# EAGLE design FTS V1.0 (EAGLE 7.5.0)
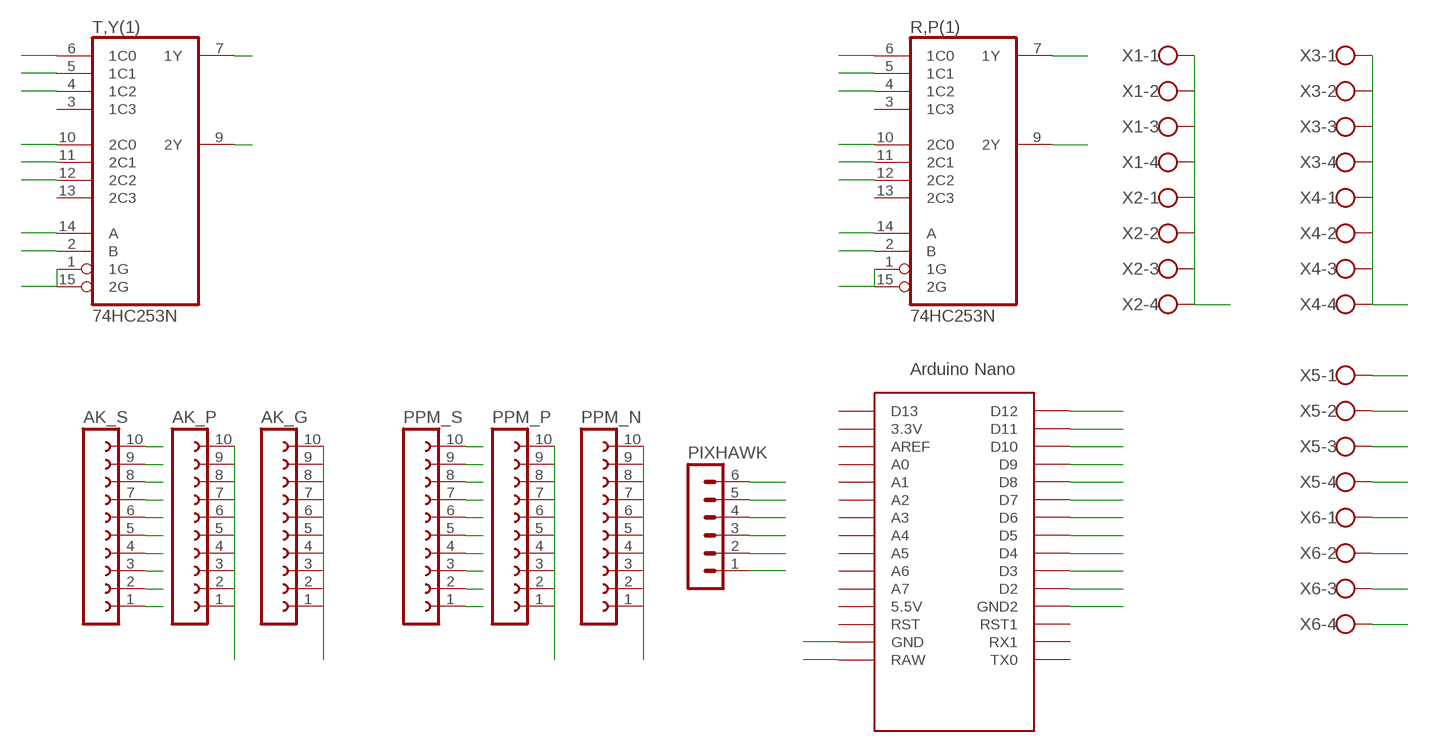
[diagram p0: schematic, sheet 1]

## Parts
AK_G  FE10-1  [FE10]
AK_P  FE10-1  [FE10]
AK_S  FE10-1  [FE10]
PIXHAWK  MA06-1  [MA06-1]
PPM_N  FE10-1  [FE10]
PPM_P  FE10-1  [FE10]
PPM_S  FE10-1  [FE10]
R,P(1)  74HC253N  [DIL16]
T,Y(1)  74HC253N  [DIL16]
U$1  NANO  [NANO]
X1  W237-4  [W237-4]
X2  W237-4  [W237-4]
X3  W237-4  [W237-4]
X4  W237-4  [W237-4]
X5  W237-4  [W237-4]
X6  W237-4  [W237-4]

## Nets
AUX2: AK_S.7 U$1.D4
DROP: AK_S.10 X6.4
FTS-P: R,P(1).12(2C2) U$1.D10
FTS-R: R,P(1).4(1C2) U$1.D9
FTS-T: T,Y(1).4(1C2) U$1.D11
FTS-Y: T,Y(1).12(2C2) U$1.D6
GBL-P: AK_S.9 X6.3
GBL-R: AK_S.8 X6.2
GEAR: AK_S.6 U$1.D5
GND: AK_G.1 AK_G.2 AK_G.3 AK_G.4 AK_G.5 AK_G.6 AK_G.7 AK_G.8 AK_G.9 AK_G.10 PIXHAWK.6 PPM_N.1 PPM_N.2 PPM_N.3 PPM_N.4 PPM_N.5 PPM_N.6 PPM_N.7 PPM_N.8 PPM_N.9 PPM_N.10 R,P(1).1(1G) R,P(1).15(2G) T,Y(1).1(1G) T,Y(1).15(2G) U$1.GND U$1.GND1(GND2) X3.1 X3.2 X3.3 X3.4 X4.1 X4.2 X4.3 X4.4
N$50: PPM_S.10
N$51: PPM_S.9
N$52: PPM_S.8
N$53: PPM_S.7
N$54: PPM_S.6
N$59: PIXHAWK.5
PPM_FM: PPM_S.5 U$1.D8
PX-P: PIXHAWK.2 R,P(1).11(2C1)
PX-R: PIXHAWK.1 R,P(1).5(1C1)
PX-T: PIXHAWK.3 T,Y(1).5(1C1)
PX-Y: PIXHAWK.4 T,Y(1).11(2C1)
RX-FM: AK_S.5 U$1.D7
RX-P: AK_S.2 PPM_S.2 R,P(1).10(2C0)
RX-R: AK_S.1 PPM_S.1 R,P(1).6(1C0)
RX-T: AK_S.3 PPM_S.3 T,Y(1).6(1C0) U$1.D12
RX-Y: AK_S.4 PPM_S.4 T,Y(1).10(2C0)
S1: R,P(1).14(A) T,Y(1).14(A) U$1.D2
S2: R,P(1).2(B) T,Y(1).2(B) U$1.D3
S-P: R,P(1).9(2Y) X5.2
S-R: R,P(1).7(1Y) X5.1
S-T: T,Y(1).7(1Y) X5.3
S-Y: T,Y(1).9(2Y) X5.4 X6.1
VCC: AK_P.1 AK_P.2 AK_P.3 AK_P.4 AK_P.5 AK_P.6 AK_P.7 AK_P.8 AK_P.9 AK_P.10 PPM_P.1 PPM_P.2 PPM_P.3 PPM_P.4 PPM_P.5 PPM_P.6 PPM_P.7 PPM_P.8 PPM_P.9 PPM_P.10 U$1.RAW X1.1 X1.2 X1.3 X1.4 X2.1 X2.2 X2.3 X2.4
Unconnected: R,P(1).3(1C3) R,P(1).13(2C3) T,Y(1).3(1C3) T,Y(1).13(2C3) U$1.3.3V U$1.5V(5.5V) U$1.A0 U$1.A1 U$1.A2 U$1.A3 U$1.A4 U$1.A5 U$1.A6 U$1.A7 U$1.AREF U$1.D13 U$1.ICSP1 U$1.ICSP2 U$1.ICSP3 U$1.ICSP4 U$1.ICSP5 U$1.ICSP6 U$1.RST U$1.RST1 U$1.RX1 U$1.TX0

## Power pins joined to a net without a drawn wire
GND: R,P(1).8(GND) T,Y(1).8(GND)
VCC: R,P(1).16(VCC) T,Y(1).16(VCC)

## Library data of the parts
AK_G AK_P AK_S PPM_N PPM_P PPM_S = con-lsta:FE10-1: FEMALE HEADER; OC_FARNELL: unknown; OC_NEWARK: unknown
PIXHAWK = con-lstb:MA06-1: PIN HEADER; OC_FARNELL: unknown; OC_NEWARK: unknown
R,P(1) T,Y(1) = 74xx-eu:74*253: Dual 4-to 1 line data SELECTOR/MULTIPLEXER, 3-state
U$1 = Arduino-clone:NANO: Arduino Nano
X1-X6 = con-wago-500:W237-4: WAGO SCREW CLAMP; OC_FARNELL: unknown; OC_NEWARK: unknown

## Board
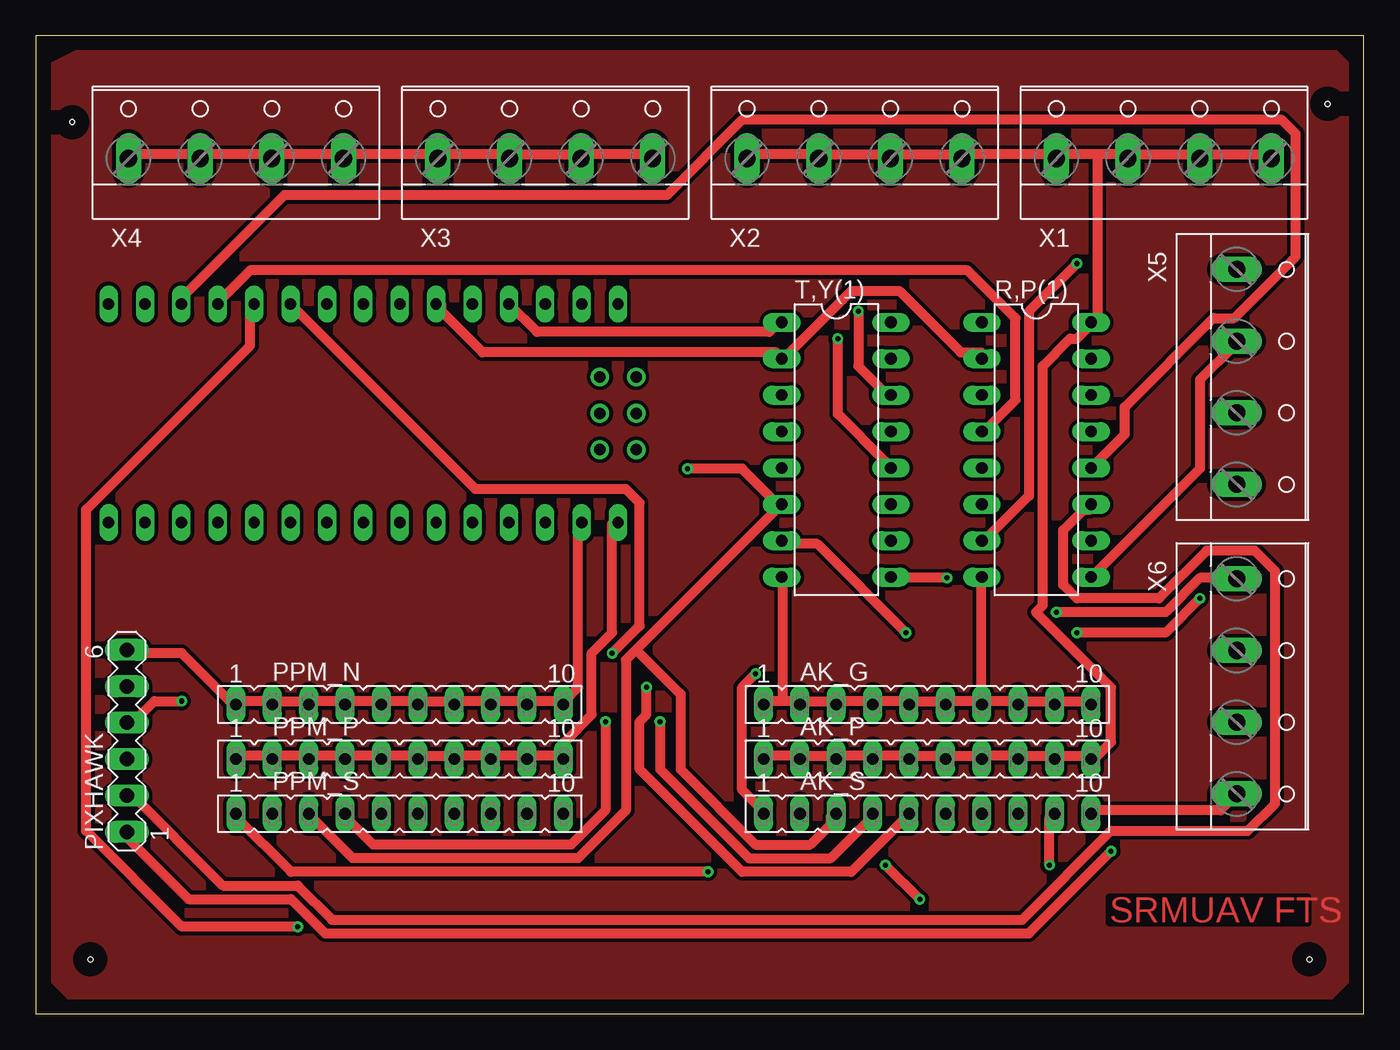
[diagram p1: board, top side]
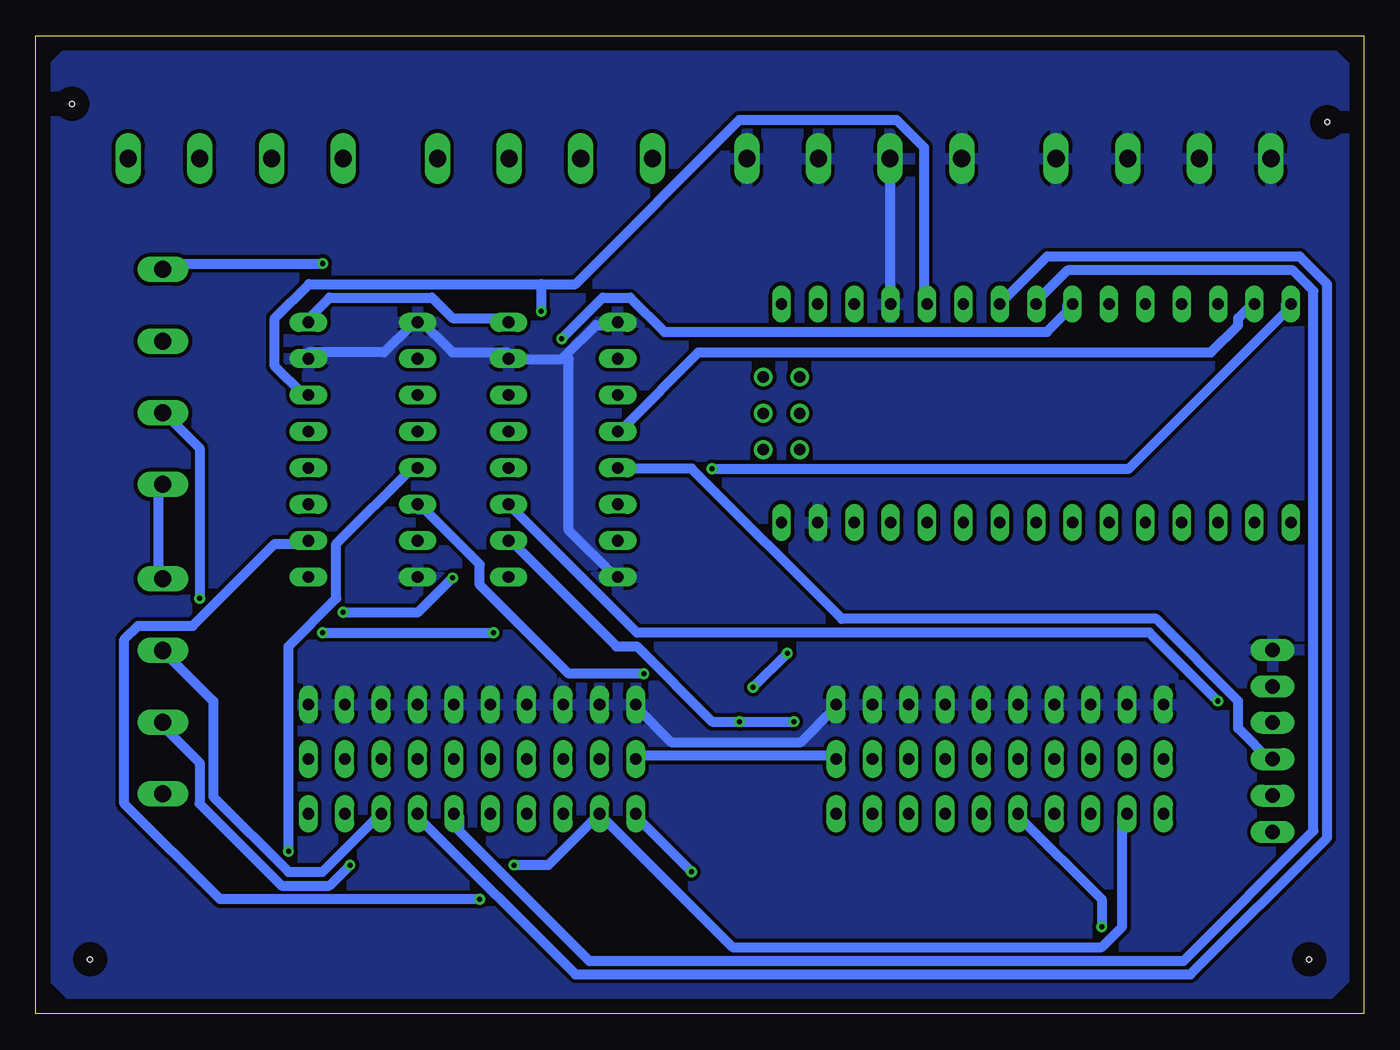
[diagram p2: board, bottom side, seen from below]

Size 92.69 x 68.25 mm. Coordinates in mm from the lower left corner, seen from the top.
Outline: 0,0 92.69,0 92.69,68.25 0,68.25 0,0
Copper layers (1*16): Top 0.035mm / dielectric 1.5mm / Bottom 0.035mm
Design rules "default *": minimum track width 0.7mm, minimum drill 0.35mm, track to track 10mil, track to pad 10mil, pad to pad 10mil, via to via 10mil, smd to smd 10mil, copper to edge 40mil, drill to drill 6mil, minimum pad ring 10mil, minimum via ring 8mil, stop-mask expansion 4mil, vias tented up to drill 0mil, thermal gap 10mil
Holes 0.35 mm at 3.81,3.81 88.9,3.81 90.17,63.5 2.54,62.23

### Footprints (pad centres in the part's own frame; a part is rotated, then mirrored left to right if it is on the bottom)
FE10 = drill 0.813 long: 1 -11.43,0; 2 -8.89,0; 3 -6.35,0; 4 -3.81,0; 5 -1.27,0; 6 1.27,0; 7 3.81,0; 8 6.35,0; 9 8.89,0; 10 11.43,0
MA06-1 = drill 1.016 long: 1 -6.35,0; 2 -3.81,0; 3 -1.27,0; 4 1.27,0; 5 3.81,0; 6 6.35,0
DIL16 = drill 0.813 long: 1 -8.89,-3.81; 2 -6.35,-3.81; 3 -3.81,-3.81; 4 -1.27,-3.81; 5 1.27,-3.81; 6 3.81,-3.81; 7 6.35,-3.81; 8 8.89,-3.81; 9 8.89,3.81; 10 6.35,3.81; 11 3.81,3.81; 12 1.27,3.81; 13 -1.27,3.81; 14 -3.81,3.81; 15 -6.35,3.81; 16 -8.89,3.81
NANO = drill 0.8 long: 3.3V -10.16,24.13; 5V -10.16,-1.27; A0 -10.16,19.05; A1 -10.16,16.51; A2 -10.16,13.97; A3 -10.16,11.43; A4 -10.16,8.89; A5 -10.16,6.35; A6 -10.16,3.81; A7 -10.16,1.27; AREF -10.16,21.59; D2 5.08,1.27; D3 5.08,3.81; D4 5.08,6.35; D5 5.08,8.89; D6 5.08,11.43; D7 5.08,13.97; D8 5.08,16.51; D9 5.08,19.05; D10 5.08,21.59; D11 5.08,24.13; D12 5.08,26.67; D13 -10.16,26.67; GND -10.16,-6.35; GND1 5.08,-1.27; RAW -10.16,-8.89; RST -10.16,-3.81; RST1 5.08,-3.81; RX1 5.08,-6.35; TX0 5.08,-8.89 | drill 0.8: ICSP1 -5.08,-10.16; ICSP2 -5.08,-7.62; ICSP3 -2.54,-10.16; ICSP4 -2.54,-7.62; ICSP5 0,-10.16; ICSP6 0,-7.62
W237-4 = drill 1.194 long: 1 -7.5,-1.27; 2 -2.5,-1.27; 3 2.5,-1.27; 4 7.5,-1.27

### Placement (x,y rotation side)
AK_G  62.23,21.59 0 top
AK_P  62.23,17.78 0 top
AK_S  62.23,13.97 0 top
PIXHAWK  6.35,19.05 90 top
PPM_N  25.4,21.59 0 top
PPM_P  25.4,17.78 0 top
PPM_S  25.4,13.97 0 top
R,P(1)  69.85,39.37 270 top
T,Y(1)  55.88,39.37 270 top
U$1  31.75,44.45 90 top
X1  78.74,60.96 0 top
X2  57.15,60.96 0 top
X3  35.56,60.96 0 top
X4  13.97,60.96 0 top
X5  85.09,44.45 270 top
X6  85.09,22.86 270 top

### Tracks (layer width: path | path; a pad name or v marks a point on that pad's centre or on a via)
AUX2
  Bottom 0.7: U$1.D4 24.97,49.98 22.11,52.84 4.46,52.84 2.55,50.93 2.55,12.29 12.09,2.75 55.02,2.75 65.99,13.73 AK_S.7
DROP
  Top 0.7: AK_S.10 74.1,14.2 82.69,14.2 83.64,15.16 X6.4
FTS-P
  Top 0.7: U$1.D10 10.18,49.98 17.34,57.13 44.05,57.13 49.3,62.38 86.98,62.38 87.94,61.43 87.94,52.84 83.64,48.55 82.21,48.55 76.01,42.35 76.01,40.44 74.1,38.53 R,P(1).12
FTS-R
  Top 0.7: U$1.D9 13.05,49.98 14.95,51.89 65.04,51.89 68.38,48.55 68.38,42.82 66.47,40.91 R,P(1).4
FTS-T
  Bottom 0.7: U$1.D11 7.8,49.5 8.75,48.55 8.75,48.07 10.66,46.16 46.44,46.16 51.68,40.91 T,Y(1).4
FTS-Y  (via drill 0.35)
  Top 0.7: v55.98,47.12 55.98,41.87 59.31,38.53 T,Y(1).12
  Bottom 0.7: v55.98,47.12 53.11,49.98 51.21,49.98 48.82,47.59 22.11,47.59 20.68,49.02 20.68,49.5 U$1.D6
GBL-P  (via drill 0.35)
  Top 0.7: v70.76,10.39 70.76,13.73 AK_S.9
  Bottom 0.7: v70.76,10.39 72.19,8.96 75.53,8.96 81.26,14.68 81.26,17.54 83.64,19.93 X6.3
GBL-R
  Bottom 0.7: AK_S.8 68.86,13.73 72.67,9.91 75.06,9.91 80.3,15.16 80.3,21.83 83.64,25.17 X6.2
GEAR
  Bottom 0.7: U$1.D5 22.59,49.98 20.68,51.89 4.94,51.89 3.51,50.45 3.51,12.77 12.57,3.71 54.07,3.71 63.13,12.77 63.13,13.73 AK_S.6
GND
  Top 0.7: X4.1 6.85,59.99 11.14,59.99 X4.2 11.62,59.99 16.38,59.99 X4.3 16.86,59.99 21.16,59.99 X4.4 21.63,59.99 27.83,59.99 X3.1 28.31,59.99 32.6,59.99 X3.2 33.08,59.99 37.85,59.99 X3.3 38.33,59.99 42.62,59.99 X3.4 | PIXHAWK.6 6.37,25.17 10.18,25.17 13.52,21.83 PPM_N.1 14,21.83 16.38,21.83 PPM_N.2 16.86,21.83 18.77,21.83 PPM_N.3 19.25,21.83 21.16,21.83 PPM_N.4 21.63,21.83 24.02,21.83 PPM_N.5 24.49,21.83 26.4,21.83 PPM_N.6 26.88,21.83 28.79,21.83 PPM_N.7 29.26,21.83 31.65,21.83 PPM_N.8 32.13,21.83 34.03,21.83 PPM_N.9 34.51,21.83 36.42,21.83 PPM_N.10 36.9,21.83 37.85,22.79 37.85,34.24 U$1.GND | 52.16,21.83 53.11,21.83 AK_G.2 53.59,21.83 55.5,21.83 AK_G.3 55.98,21.83 58.36,21.83 AK_G.4 58.84,21.83 60.75,21.83 AK_G.5 61.22,21.83 63.13,21.83 AK_G.6 63.61,21.83 65.99,21.83 | 52.16,21.83 51.21,21.83 AK_G.1 | 52.16,21.83 52.16,30.42 T,Y(1).8 | 65.99,21.83 65.99,30.42 R,P(1).8 | AK_G.10 73.62,21.83 71.24,21.83 AK_G.9 70.76,21.83 68.86,21.83 AK_G.8 68.38,21.83 66.47,21.83 AK_G.7 65.99,21.83 | U$1.GND1 33.08,49.5 34.99,47.59 51.21,47.59 51.68,48.07 T,Y(1).1
  Bottom 0.7: U$1.GND1 33.08,49.98 33.08,59.52 X3.2 | 55.74,45.92 55.98,45.68 59.31,45.68 T,Y(1).15 59.79,46.16 63.61,46.16 65.99,48.55 R,P(1).1 66.47,48.07 68.38,46.16 73.62,46.16 R,P(1).15 | 55.74,45.92 53.59,48.07 52.16,48.07 T,Y(1).1 | 55.74,45.92 55.5,45.68 55.5,33.76 52.16,30.42 T,Y(1).8 | PPM_N.10 36.9,21.36 39.28,18.97 48.34,18.97 50.73,21.36 AK_G.1
  pour Bottom: 90.17,67.31 2.54,67.31 1.27,66.04 1.27,2.54 2.54,1.27 90.17,1.27 91.44,2.54 91.44,66.04
N$1
  pour Top: 3.81,67.31 90.17,67.31 91.44,66.04 91.44,2.54 90.17,1.27 2.54,1.27 1.27,2.54 1.27,66.04
PPM_FM  (via drill 0.35)
  Top 0.7: v18.29,6.09 10.18,6.09 3.51,12.77 3.51,35.19 14.95,46.64 14.95,49.5 U$1.D8
  Bottom 0.7: v18.29,6.09 18.29,8 24.02,13.73 PPM_S.5
PX-P
  Top 0.7: R,P(1).11 73.62,35.19 73.15,35.19 71.72,33.76 71.72,29.94 72.67,28.99 78.39,28.99 81.73,32.33 85.07,32.33 86.5,30.9 86.5,14.68 84.6,12.77 75.06,12.77 68.86,6.57 20.68,6.57 18.29,8.96 13.05,8.96 6.37,15.63 PIXHAWK.2
PX-R  (via drill 0.35)
  Top 0.7: v75.06,11.34 69.33,5.62 20.2,5.62 17.82,8 10.66,8 6.37,12.29 PIXHAWK.1
  Bottom 0.7: v75.06,11.34 75.06,25.65 71.72,28.99 71.72,32.81 66.47,38.05 R,P(1).5
PX-T
  Bottom 0.7: T,Y(1).5 51.68,38.05 46.91,38.05 36.42,27.56 14.48,27.56 8.75,21.83 8.75,19.93 6.37,17.54 PIXHAWK.3
PX-Y  (via drill 0.35)
  Top 0.7: v10.18,21.83 8.28,21.83 6.37,19.93 PIXHAWK.4
  Bottom 0.7: v10.18,21.83 14.95,26.6 50.73,26.6 59.31,35.19 T,Y(1).11
RX-FM  (via drill 0.35)
  Top 0.7: v40.23,25.17 42.14,27.08 42.14,35.67 41.19,36.62 30.7,36.62 17.82,49.5 U$1.D7 | v42.62,22.79 42.62,20.88 42.14,20.4 42.14,17.06 49.3,9.91 56.93,9.91 60.75,13.73 AK_S.5
  Bottom 0.7: v42.62,22.79 v40.23,25.17
RX-P  (via drill 0.35)
  Top 0.7: v59.31,10.39 v61.7,8
  Bottom 0.7: PPM_S.2 16.86,13.73 16.86,6.09 18.29,4.66 44.05,4.66 53.11,13.73 AK_S.2 53.59,13.73 56.93,10.39 v59.31,10.39 | v61.7,8 79.83,8 86.5,14.68 86.5,26.13 85.55,27.08 81.73,27.08 76.01,32.81 74.1,32.81 R,P(1).10
RX-R  (via drill 0.35)
  Top 0.7: v46.91,9.91 17.82,9.91 14,13.73 PPM_S.1 | v50.25,23.74 49.3,22.79 49.3,15.63 50.73,14.2 AK_S.1
  Bottom 0.7: v46.91,9.91 50.73,13.73 AK_S.1 | v50.25,23.74 55.5,23.74 61.7,29.94 61.7,31.37 65.52,35.19 65.99,35.19 R,P(1).6
RX-T  (via drill 0.35)
  Top 0.7: v45.48,38.05 49.3,38.05 51.68,35.67 T,Y(1).6 51.68,35.19 41.9,25.41 | 41.9,25.41 41.19,24.7 41.19,14.2 37.85,10.86 22.11,10.86 19.25,13.73 PPM_S.3 | 41.9,25.41 45.01,22.31 45.01,17.06 50.25,11.82 54.07,11.82 55.5,13.25 55.5,13.73 AK_S.3
  Bottom 0.7: v45.48,38.05 16.38,38.05 5.41,49.02 5.41,49.5 U$1.D12
RX-Y  (via drill 0.35)
  Top 0.7: v39.76,20.4 39.76,14.2 37.37,11.82 23.54,11.82 21.63,13.73 PPM_S.4 | v43.57,20.4 43.57,17.06 49.77,10.86 55.5,10.86 58.36,13.73 AK_S.4
  Bottom 0.7: v39.76,20.4 v43.57,20.4 45.48,20.4 50.73,25.65 52.16,25.65 59.31,32.81 T,Y(1).10
S1  (via drill 0.35)
  Top 0.7: v57.41,49.02 57.41,45.21 59.31,43.3 T,Y(1).14
  Bottom 0.7: 57.41,50.93 73.62,50.93 76.01,48.55 76.01,45.21 74.1,43.3 R,P(1).14 | 57.41,50.93 55.02,50.93 43.57,62.38 32.6,62.38 30.7,60.47 30.7,49.98 U$1.D2 | 57.41,50.93 v57.41,49.02
S2
  Top 0.7: U$1.D3 28.31,49.5 28.31,49.02 31.17,46.16 51.68,46.16 T,Y(1).2 52.16,45.68 56.93,50.45 60.27,50.45 64.56,46.16 65.99,46.16 R,P(1).2
S-P
  Top 0.7: R,P(1).9 74.1,30.9 81.26,38.05 81.26,44.25 83.64,46.64 X5.2
S-R  (via drill 0.35)
  Top 0.7: v72.67,52.36 69.33,49.02 69.33,36.15 66.47,33.28 R,P(1).7
  Bottom 0.7: v72.67,52.36 83.64,52.36 X5.1
S-T  (via drill 0.35)
  Top 0.7: v60.75,26.6 54.55,32.81 52.16,32.81 T,Y(1).7 | v72.67,26.6 78.87,26.6 v81.26,28.99
  Bottom 0.7: v72.67,26.6 v60.75,26.6 | v81.26,28.99 81.26,39.48 83.64,41.87 X5.3
S-Y  (via drill 0.35)
  Top 0.7: v63.61,30.42 59.79,30.42 T,Y(1).9 | v71.24,28.04 78.87,28.04 81.26,30.42 83.64,30.42 X6.1
  Bottom 0.7: v63.61,30.42 65.99,28.04 v71.24,28.04 | X5.4 84.12,36.62 84.12,30.42 X6.1
VCC
  Top 0.7: X2.1 49.77,59.99 54.55,59.99 X2.2 55.02,59.99 59.31,59.99 X2.3 59.79,59.99 64.56,59.99 X2.4 65.04,59.99 71.24,59.99 | 74.1,59.99 76.01,59.99 X1.2 76.49,59.99 80.78,59.99 X1.3 81.26,59.99 86.03,59.99 X1.4 | 74.1,59.99 71.24,59.99 | 74.1,59.99 74.1,48.55 R,P(1).16 73.62,48.07 72.67,47.12 72.19,47.12 70.29,45.21 70.29,28.51 69.81,28.04 75.06,22.79 75.06,18.97 74.1,18.02 AK_P.10 73.62,18.02 71.24,18.02 AK_P.9 70.76,18.02 68.86,18.02 AK_P.8 68.38,18.02 66.47,18.02 AK_P.7 65.99,18.02 63.61,18.02 AK_P.6 63.13,18.02 61.22,18.02 AK_P.5 60.75,18.02 58.84,18.02 AK_P.4 58.36,18.02 55.98,18.02 AK_P.3 55.5,18.02 53.59,18.02 AK_P.2 53.11,18.02 51.21,18.02 AK_P.1 | 71.24,59.99 X1.1 | PPM_P.1 14,18.02 16.38,18.02 PPM_P.2 16.86,18.02 18.77,18.02 PPM_P.3 19.25,18.02 21.16,18.02 PPM_P.4 21.63,18.02 24.02,18.02 PPM_P.5 24.49,18.02 26.4,18.02 PPM_P.6 26.88,18.02 28.79,18.02 PPM_P.7 29.26,18.02 31.65,18.02 PPM_P.8 32.13,18.02 34.03,18.02 PPM_P.9 34.51,18.02 36.42,18.02 PPM_P.10 36.9,18.02 36.9,18.97 38.8,20.88 38.8,25.17 40.23,26.6 40.23,34.24 U$1.RAW
  Bottom 0.7: T,Y(1).16 59.79,48.55 63.61,48.55 65.04,49.98 72.19,49.98 73.62,48.55 R,P(1).16 | AK_P.1 50.73,18.02 36.9,18.02 PPM_P.10

### Text on the board
Top: SRMUAV FTS